# Altium schematic sheet C-05 CPU PERI2.SchDoc
size 513 x 386 mm
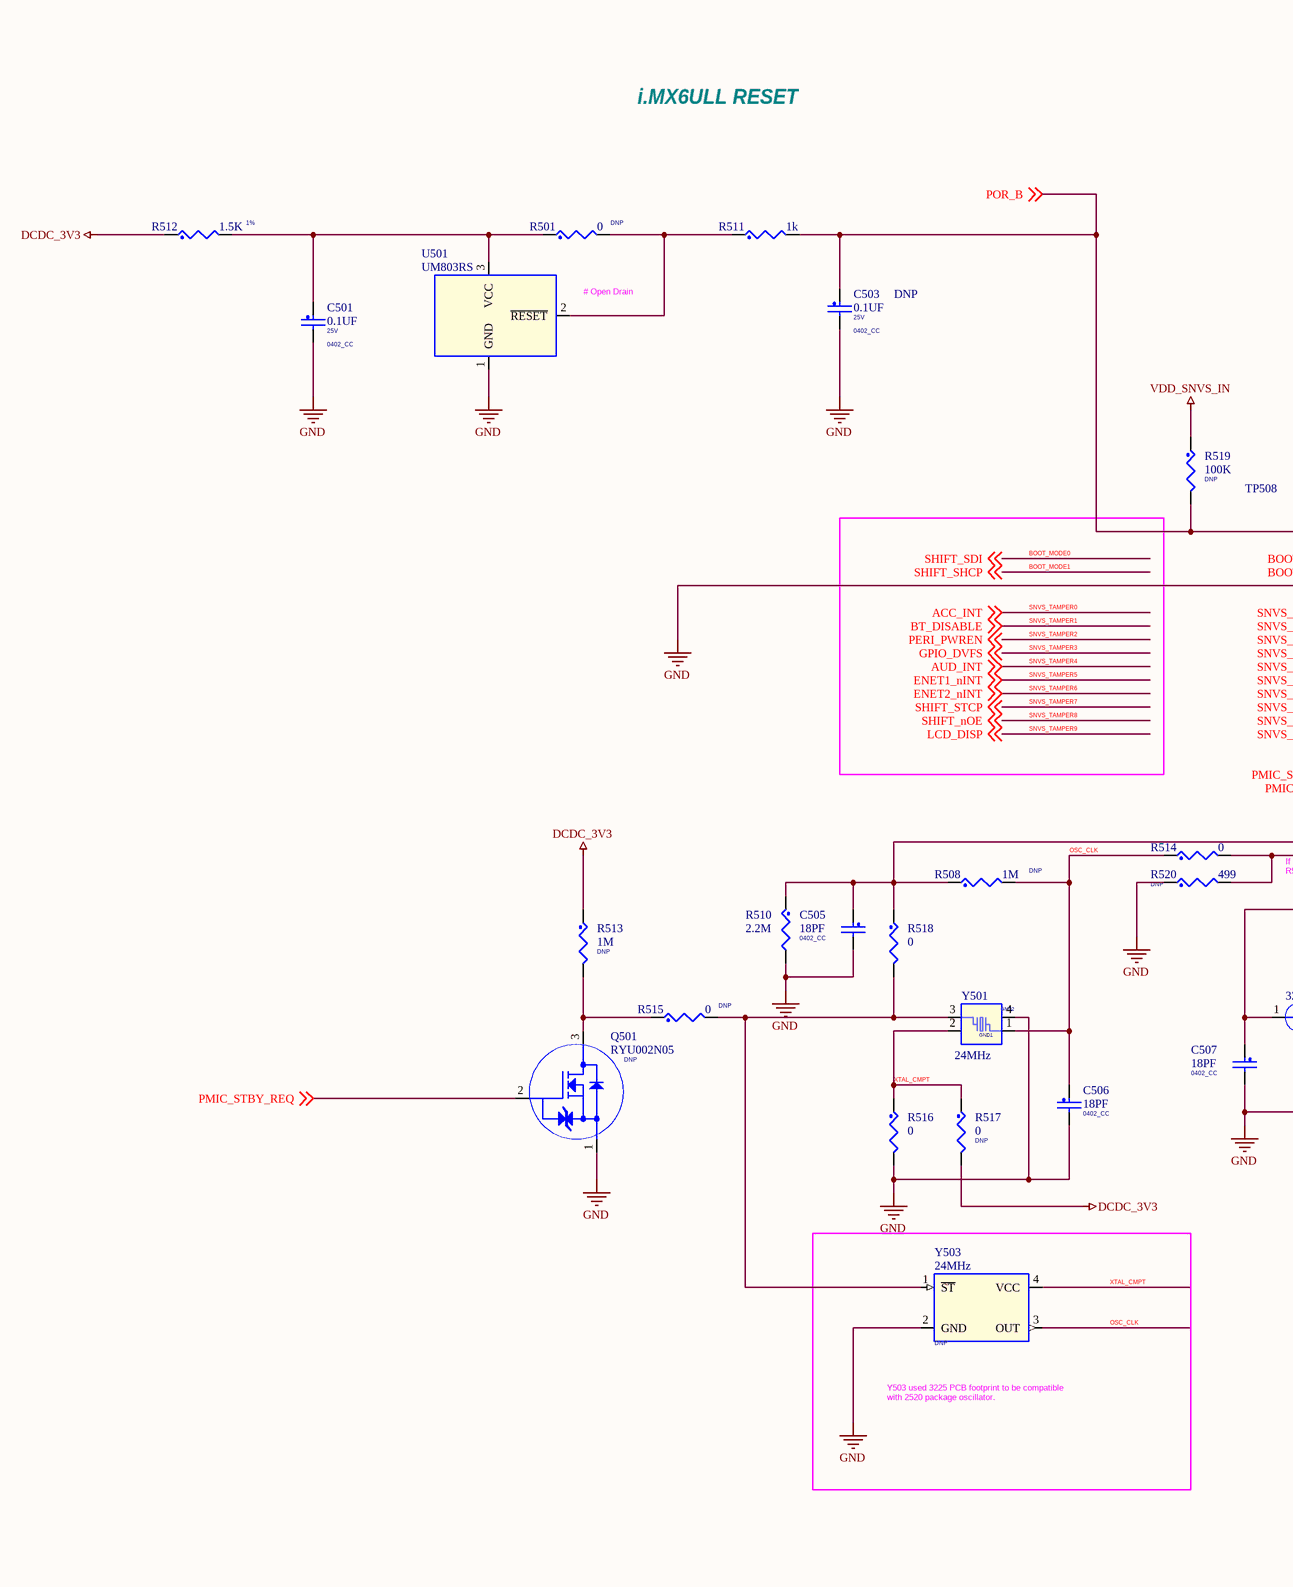
[diagram p0: C-05 CPU PERI2.SchDoc, left]
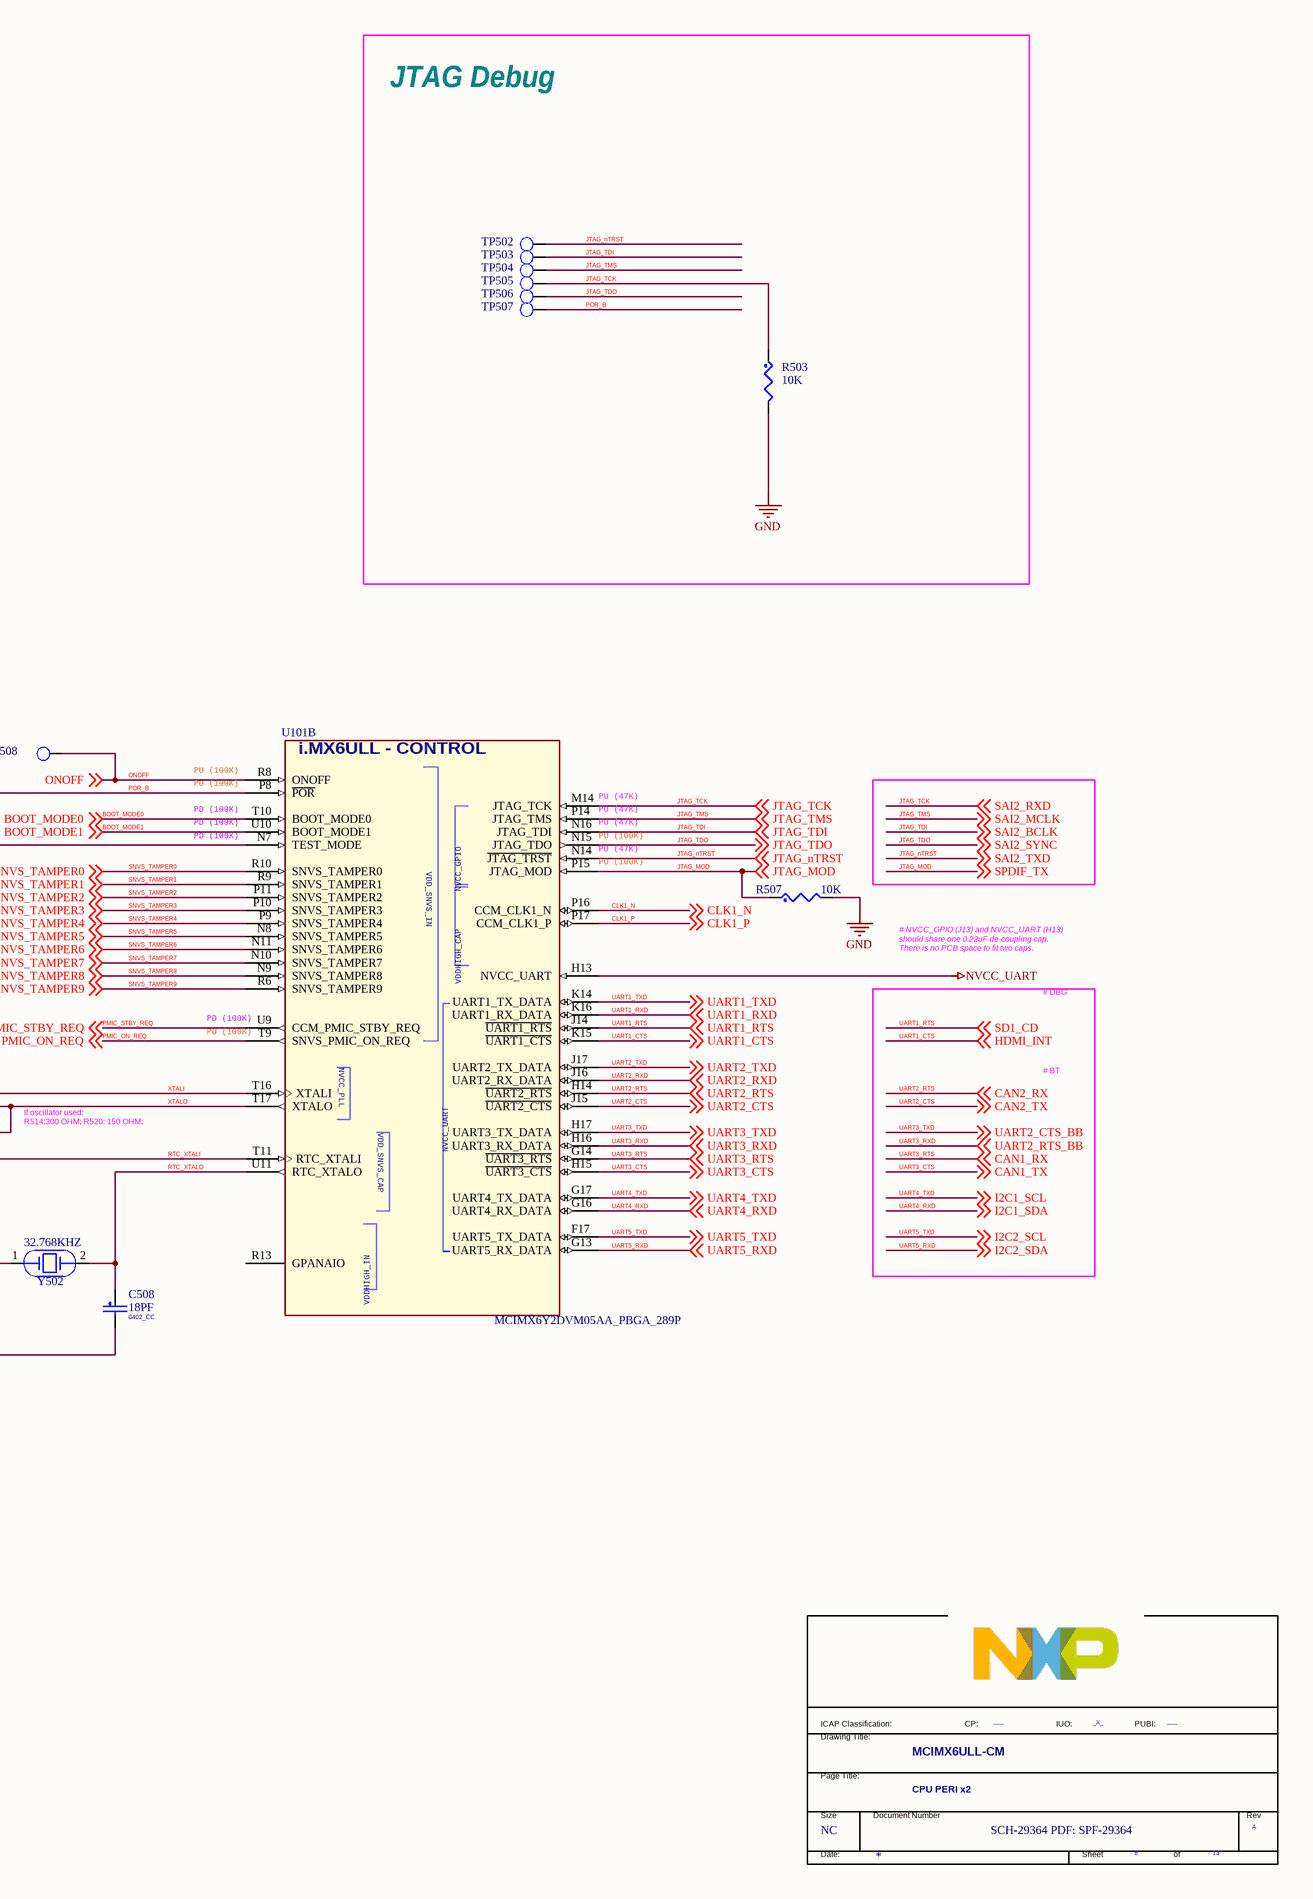
[diagram p1: C-05 CPU PERI2.SchDoc, right]

## Parts
*  FIUO: _X_  PUBI: ___  Doc: SCH-29364 PDF: SPF-29364  RevCode: A  Title: MCIMX6ULL-CM  Page Size: NC  Page Number: 8  Page Count: 13  PageTitle: CPU PERI x2  (hidden comment: TitleBlock_FS)  (graphical)
C501  0.1UF  VOLTAGE: 25V  PCB Footprint: 0402_CC  [C0402_H0.5mm]
C503  0.1UF  ASSY_OPT: DNP  VOLTAGE: 25V  PCB Footprint: 0402_CC  [C0402_H0.5mm]
C505  18PF  PCB Footprint: 0402_CC  [C0402_H0.5mm]
C506  18PF  PCB Footprint: 0402_CC  [C0402_H0.5mm]
C507  18PF  PCB Footprint: 0402_CC  [C0402_H0.5mm]
C508  18PF  PCB Footprint: 0402_CC  [C0402_H0.5mm]
Q501  RYU002N05  ASSY_OPT: DNP  [SOT323-3]
R501  0  ASSY_OPT: DNP  [R0402_H0.35mm]
R503  10K  [R0402_H0.35mm]
R507  10K  [R0402_H0.35mm]
R508  1M  ASSY_OPT: DNP  [R0402_H0.35mm]
R510  2.2M  [R0402_H0.35mm]
R511  1k  [R0402_H0.35mm]
R512  1.5K  Tolerance: 1%  [R0402_H0.35mm]
R513  1M  ASSY_OPT: DNP  [R0402_H0.35mm]
R514  0  [R0402_H0.35mm]
R515  0  ASSY_OPT: DNP  [R0402_H0.35mm]
R516  0  [R0402_H0.35mm]
R517  0  ASSY_OPT: DNP  [R0402_H0.35mm]
R518  0  [R0402_H0.35mm]
R519  100K  ASSY_OPT: DNP  [R0402_H0.35mm]
R520  499  ASSY_OPT: DNP  [R0402_H0.35mm]
TP502  TP_35MIL  [TPAD_035]  (value not drawn)
TP503  TP_35MIL  [TPAD_035]  (value not drawn)
TP504  TP_35MIL  [TPAD_035]  (value not drawn)
TP505  TP_35MIL  [TPAD_035]  (value not drawn)
TP506  TP_35MIL  [TPAD_035]  (value not drawn)
TP507  TP_35MIL  [TPAD_035]  (value not drawn)
TP508  TP_35MIL  [TPAD_035]  (value not drawn)
U101  MCIMX6Y2DVM05AA_PBGA_289P  [BGA289_14x14mm]  (part B of 11)
U501  UM803RS  [SOT23-3]
Y501  24MHz  [SO3225]
Y502  32.768KHZ  [CM7V-T1A]
Y503  24MHz  ASSY_OPT: DNP  [SO3225]

## Blocks framed on the sheet
JTAG Debug: R503 TP502-TP507

## Nets
DCDC_3V3: R512.1 R513.1 R517.2
GND: C501.2 C503.2 C505.2 C506.2 C507.2 C508.2 Q501.1(SOURCE) R503.2 R507.2 R510.2 R516.2 R520.1 U101.N7(TEST_MODE) U501.1(GND) Y501.4(GND2) Y503.2(GND)
NVCC_UART: U101.H13(NVCC_UART)
VDD_SNVS_IN: R519.1
BOOT_MODE0: U101.T10(BOOT_MODE0) ; off-sheet BOOT_MODE0, off-sheet SHIFT_SDI  [also labelled SHIFT_SDI]
BOOT_MODE1: U101.U10(BOOT_MODE1) ; off-sheet BOOT_MODE1, off-sheet SHIFT_SHCP  [also labelled SHIFT_SHCP]
CLK1_N: U101.P16(CCM_CLK1_N) ; off-sheet CLK1_N
CLK1_P: U101.P17(CCM_CLK1_P) ; off-sheet CLK1_P
JTAG_MOD: R507.1 U101.P15(JTAG_MOD) ; off-sheet JTAG_MOD, off-sheet SPDIF_TX  [also labelled SPDIF_TX]
JTAG_nTRST: TP502.1(TP) U101.N14(~{JTAG_TRST}) ; off-sheet SAI2_TXD, off-sheet JTAG_nTRST  [also labelled SAI2_TXD]
JTAG_TCK: R503.1 TP505.1(TP) U101.M14(JTAG_TCK) ; off-sheet SAI2_RXD, off-sheet JTAG_TCK  [also labelled SAI2_RXD]
JTAG_TDI: TP503.1(TP) U101.N16(JTAG_TDI) ; off-sheet SAI2_BCLK, off-sheet JTAG_TDI  [also labelled SAI2_BCLK]
JTAG_TDO: TP506.1(TP) U101.N15(JTAG_TDO) ; off-sheet SAI2_SYNC, off-sheet JTAG_TDO  [also labelled SAI2_SYNC]
JTAG_TMS: TP504.1(TP) U101.P14(JTAG_TMS) ; off-sheet SAI2_MCLK, off-sheet JTAG_TMS  [also labelled SAI2_MCLK]
ONOFF: TP508.1(TP) U101.R8(ONOFF) ; off-sheet ONOFF
OSC_CLK: C506.1 R508.2 R514.1 Y501.1 Y503.3(OUT)
PMIC_ON_REQ: U101.T9(SNVS_PMIC_ON_REQ) ; off-sheet PMIC_ON_REQ
PMIC_STBY_REQ: Q501.2(GATE) U101.U9(CCM_PMIC_STBY_REQ) ; off-sheet PMIC_STBY_REQ
POR_B: C503.1 R511.2 R519.2 TP507.1(TP) U101.P8(~{POR}) ; off-sheet POR_B
RTC_XTALI: C507.1 U101.T11(RTC_XTALI) Y502.1
RTC_XTALO: C508.1 U101.U11(RTC_XTALO) Y502.2
SNVS_TAMPER0: U101.R10(SNVS_TAMPER0) ; off-sheet ACC_INT, off-sheet SNVS_TAMPER0  [also labelled ACC_INT]
SNVS_TAMPER1: U101.R9(SNVS_TAMPER1) ; off-sheet BT_DISABLE, off-sheet SNVS_TAMPER1  [also labelled BT_DISABLE]
SNVS_TAMPER2: U101.P11(SNVS_TAMPER2) ; off-sheet SNVS_TAMPER2, off-sheet PERI_PWREN  [also labelled PERI_PWREN]
SNVS_TAMPER3: U101.P10(SNVS_TAMPER3) ; off-sheet SNVS_TAMPER3, off-sheet GPIO_DVFS  [also labelled GPIO_DVFS]
SNVS_TAMPER4: U101.P9(SNVS_TAMPER4) ; off-sheet AUD_INT, off-sheet SNVS_TAMPER4  [also labelled AUD_INT]
SNVS_TAMPER5: U101.N8(SNVS_TAMPER5) ; off-sheet SNVS_TAMPER5, off-sheet ENET1_nINT  [also labelled ENET1_nINT]
SNVS_TAMPER6: U101.N11(SNVS_TAMPER6) ; off-sheet SNVS_TAMPER6, off-sheet ENET2_nINT  [also labelled ENET2_nINT]
SNVS_TAMPER7: U101.N10(SNVS_TAMPER7) ; off-sheet SNVS_TAMPER7, off-sheet SHIFT_STCP  [also labelled SHIFT_STCP]
SNVS_TAMPER8: U101.N9(SNVS_TAMPER8) ; off-sheet SNVS_TAMPER8, off-sheet SHIFT_nOE  [also labelled SHIFT_nOE]
SNVS_TAMPER9: U101.R6(SNVS_TAMPER9) ; off-sheet SNVS_TAMPER9, off-sheet LCD_DISP  [also labelled LCD_DISP]
UART1_CTS: U101.K15(~{UART1_CTS}) ; off-sheet HDMI_INT, off-sheet UART1_CTS  [also labelled HDMI_INT]
UART1_RTS: U101.J14(~{UART1_RTS}) ; off-sheet SD1_CD, off-sheet UART1_RTS  [also labelled SD1_CD]
UART1_RXD: U101.K16(UART1_RX_DATA) ; off-sheet UART1_RXD
UART1_TXD: U101.K14(UART1_TX_DATA) ; off-sheet UART1_TXD
UART2_CTS: U101.J15(~{UART2_CTS}) ; off-sheet CAN2_TX, off-sheet UART2_CTS  [also labelled CAN2_TX]
UART2_RTS: U101.H14(~{UART2_RTS}) ; off-sheet CAN2_RX, off-sheet UART2_RTS  [also labelled CAN2_RX]
UART2_RXD: U101.J16(UART2_RX_DATA) ; off-sheet UART2_RXD
UART2_TXD: U101.J17(UART2_TX_DATA) ; off-sheet UART2_TXD
UART3_CTS: U101.H15(~{UART3_CTS}) ; off-sheet CAN1_TX, off-sheet UART3_CTS  [also labelled CAN1_TX]
UART3_RTS: U101.G14(~{UART3_RTS}) ; off-sheet CAN1_RX, off-sheet UART3_RTS  [also labelled CAN1_RX]
UART3_RXD: U101.H16(UART3_RX_DATA) ; off-sheet UART2_RTS_BB, off-sheet UART3_RXD  [also labelled UART2_RTS_BB]
UART3_TXD: U101.H17(UART3_TX_DATA) ; off-sheet UART2_CTS_BB, off-sheet UART3_TXD  [also labelled UART2_CTS_BB]
UART4_RXD: U101.G16(UART4_RX_DATA) ; off-sheet I2C1_SDA, off-sheet UART4_RXD  [also labelled I2C1_SDA]
UART4_TXD: U101.G17(UART4_TX_DATA) ; off-sheet I2C1_SCL, off-sheet UART4_TXD  [also labelled I2C1_SCL]
UART5_RXD: U101.G13(UART5_RX_DATA) ; off-sheet I2C2_SDA, off-sheet UART5_RXD  [also labelled I2C2_SDA]
UART5_TXD: U101.F17(UART5_TX_DATA) ; off-sheet I2C2_SCL, off-sheet UART5_TXD  [also labelled I2C2_SCL]
XTAL_CMPT: R516.1 R517.1 Y501.2(GND1) Y503.4(VCC)
XTALI: C505.1 R508.1 R510.1 R518.1 U101.T16(XTALI)
XTALO: R514.2 R520.2 U101.T17(XTALO)
NetC501_1: C501.1 R501.1 R512.2 U501.3(VCC)
NetQ501_3: Q501.3(DRAIN) R513.2 R515.1
NetR501_2: R501.2 R511.1 U501.2(~{RESET})
NetR515_2: R515.2 R518.2 Y501.3 Y503.1(~{ST})

Not connected (* = marked no-connect by the designer): U101 R13(GPANAIO)

## Notes on the sheet
- i.MX6ULL RESET
- (near U501) # Open Drain
- PU (100K)
- PD (100K)
- (near U101) PU (47K)
- (near U101) PU (100K)
- # NVCC_GPIO (J13) and NVCC_UART (H13)
  should share one 0.22uF de-coupling cap.
  There is no PCB space to fit two caps.
- (near U101) PD (100K)
- # DBG
- # BT
- If oscillator used:
  R514:300 OHM; R520: 150 OHM;
- Y503 used 3225 PCB footprint to be compatible
  with 2520 package oscillator.
- (in symbol MCIMX6Y2DVM05AA_PBGA_289P, part B) i.MX6ULL - CONTROL; VDDHIGH_CAP; VDDHIGH_IN
- (in symbol TitleBlock_FS) ICAP Classification:; CP:; IUO:; PUBI:; Drawing Title:; Page Title:; Size; Document Number; Rev; Date:; Sheet; of

## Library data of the parts
* = TitleBlock_FS: OrgAddr2: Austin, TX 78735-8598; OrgAddr1: 6501 William Cannon Drive West; OrgName: Freescale Semiconductor; FCP: ___; Page Create Date: March  8, 1995; Page Modify Date: *
C501 C503 = CAP_NP: CAP CER 0.1UF 25V 10% X5R 0402; CLASS: DISCRETE; AGILE_PN: 150-78633; MFG_NAME01: YAGEO AMERICA; MFG_PN01: CC0402KRX5R8BB104; CAD_APPROVED: Yes; FPLIST: CC0402_25,CC0402_HD,0402_CC; Tolerance: 10%; ROHS: Yes; HEIGHT: 0.55MM
C505 = CAP_NP: CAP CER 18PF 50V 1% C0G 0402; CLASS: DISCRETE; FPLIST: CC0402_25,CC0402_HD,0402_CC; AGILE_PN: 150-76630; MFG_NAME01: CAPAX TECHNOLOGIES INC.; MFG_PN01: 0402G180F500SNT; CAD_APPROVED: Yes; PRIORITY_PN: 021-00248; ROOM: ATLAS-AP; Tolerance: 1%; ROHS: Yes; HEIGHT: 0.59MM
C506-C508 = CAP_NP: CAP CER 18PF 50V 1% C0G 0402; CLASS: DISCRETE; ROOM: ATLAS-AP; PRIORITY_PN: 021-00248; CAD_APPROVED: Yes; MFG_PN01: 0402G180F500SNT; MFG_NAME01: CAPAX TECHNOLOGIES INC.; AGILE_PN: 150-76630; FPLIST: CC0402_25,CC0402_HD,0402_CC; HEIGHT: 0.59MM; ROHS: Yes; Tolerance: 1%
Q501 = NMOSFET_3P_ESD_DIODE: TRAN NMOS SW 0.9V DRIVE 50V UMT3; CLASS: IC; CAD_APPROVED: Yes; MFG_NAME01: ROHM; AGILE_PN: 480-78966; PCB Footprint: SOT323_3; HEIGHT: 0.9MM; ROHS: Yes; MFG_PN01: RYU002N05
R501 R515-R518 = RES: RES MF ZERO OHM 1/16W 5% 0402; CLASS: DISCRETE; AGILE_PN: 470-75394; MFG_NAME01: ROHM; MFG_PN01: MCR01MZPJ000; CAD_APPROVED: Yes; FPLIST: RC0402_25,RC0402_HD,RC0402_X2,0402_CC; PCB Footprint: 0402_CC; Tolerance: 5%; ROHS: Yes
R503 R507 = RES: RES MF 10K 1/16W 5% 0402; CLASS: DISCRETE; PCB Footprint: 0402_CC; AGILE_PN: 470-75557; MFG_NAME01: VISHAY INTERTECHNOLOGY; MFG_PN01: CRCW040210K0JNED; CAD_APPROVED: Yes; FPLIST: RC0402_25,RC0402_HD,0402_CC; HEIGHT: 0.4 MM; TOL: 5%; Tolerance: 5%; ROHS: Yes
R508 = RES: RES MF 1.0M 1/10W 5% 0402; CLASS: DISCRETE; AGILE_PN: 470-79978; MFG_NAME01: PANASONIC; MFG_PN01: ERJ-2GEJ105X; CAD_APPROVED: Yes; FPLIST: RC0402_25,RC0402_HD,0402_CC; PCB Footprint: 0402_CC; Tolerance: 5%; ROHS: Yes
R510 = RES: RES MF 2.2M  1/16W 1% 0402; CLASS: DISCRETE; AGILE_PN: 470-31210; MFG_NAME01: KOA SPEER; MFG_PN01: RK73H1ETTP2204F; CAD_APPROVED: Yes; FPLIST: RC0402_25,RC0402_HD,0402_CC; PCB Footprint: 0402_CC; Tolerance: 1%; ROHS: Yes
R511 = RES: RES MF 1.0K 1/16W 5% 0402; CLASS: DISCRETE; FPLIST: RC0402_25,RC0402_HD,RC0402_X2,0402_CC; CAD_APPROVED: Yes; MFG_PN01: CRCW04021K00JNED; MFG_NAME01: VISHAY INTERTECHNOLOGY; AGILE_PN: 470-75555; PCB Footprint: 0402_CC; ROHS: Yes; Tolerance: 5%
R512 = RES: RES MF 1.5K 1/16W 1% 0402; CLASS: DISCRETE; FPLIST: RC0402_25,RC0402_HD,0402_CC; CAD_APPROVED: Yes; MFG_PN01: CR0402-FX-1501GLF; MFG_NAME01: BOURNS; AGILE_PN: 470-80487; PCB Footprint: 0402_CC; ROHS: Yes
R513 = RES: RES MF 1.0M 1/10W 5% 0402; CLASS: DISCRETE; FPLIST: RC0402_25,RC0402_HD,0402_CC; CAD_APPROVED: Yes; MFG_PN01: ERJ-2GEJ105X; MFG_NAME01: PANASONIC; AGILE_PN: 470-79978; PCB Footprint: 0402_CC; ROHS: Yes; Tolerance: 5%
R514 = RES: RES MF ZERO OHM 1/16W 5% 0402; CLASS: DISCRETE; FPLIST: RC0402_25,RC0402_HD,RC0402_X2,0402_CC; CAD_APPROVED: Yes; MFG_PN01: MCR01MZPJ000; MFG_NAME01: ROHM; AGILE_PN: 470-75394; PCB Footprint: 0402_CC; ROHS: Yes; Tolerance: 5%
R519 = RES: RES MF 100K 1/16W 5% 0402; CLASS: DISCRETE; PCB Footprint: 0402_CC; AGILE_PN: 470-75597; MFG_NAME01: KOA SPEER; MFG_PN01: RK73B1ETTP104J; CAD_APPROVED: Yes; FPLIST: RC0402_25,RC0402_HD,0402_CC; Tolerance: 5%; ROHS: Yes
R520 = RES: RES MF 499 OHM 1/16W 1% 0402; CLASS: DISCRETE; FPLIST: RC0402_25,RC0402_HD,0402_CC; CAD_APPROVED: Yes; MFG_PN01: RK73H1ETTP4990F; MFG_NAME01: KOA SPEER; AGILE_PN: 470-30807; PCB Footprint: 0402_CC; HEIGHT: 0.40 MM; ROHS: Yes; Tolerance: 1%
TP502-TP508 = T POINT R: TEST POINT PAD .035 SMT, no part to order; CLASS: IC; PCB Footprint: testpoint_35mil; CAD_APPROVED: Yes; AGILE_PN: 510-75618; HEIGHT: 0.1MM; ROHS: Yes
U101 = MCIMX6Y2DVM05AA_PBGA_289P: CLASS: IC
U501 = SGM803_SOT23-3P: IC VOLT MONITOR 2.63V RST VTH 1-5.5V AUTO SOT-23; AGILE_PN: 315-80553; MFG_NAME01: Union Semiconductor, Inc; CAD_APPROVED: Yes; CLASS: IC; PCB Footprint: sot-23; MFG_PN01: UM803RS; ROHS: Yes; HEIGHT: 1.25MM
Y501 = CRYSTAL_JXS63: XTAL 24MHZ -- 30PPM 3.2X2.5MM SMD; CLASS: IC; CAD_APPROVED: Yes; MFG_PN01: 7V24000002; MFG_NAME01: TXC CORP; AGILE_PN: 230-77452; PCB Footprint: xtlosc4_3p2x2p5mm_sm; HEIGHT: 0.9MM; ROHS: Yes
Y502 = XTAL: XTAL 32.768KHZ 12.5pF -- SMT; CLASS: IC; CAD_APPROVED: Yes; MFG_PN01: CM7V-T1A, 32.768KHz, 12.5pF, 20ppm, TA, QC; MFG_NAME01: Micro Crystal; AGILE_PN: 230-77879; PCB Footprint: XTAL2-3p2x1p5-SM; HEIGHT: 0.65MM; ROHS: Yes
Y503 = SG8002: OSC 24MHZ FIXED 2.7-3.3V SMT; CLASS: IC; AGILE_PN: 230-78110; MFG_NAME01: NDK; MFG_PN01: ERG3199A; CAD_APPROVED: Yes; PCB Footprint: xtlosc4_3p2x2p5mm_sm; ROHS: Yes; HEIGHT: 0.9MM